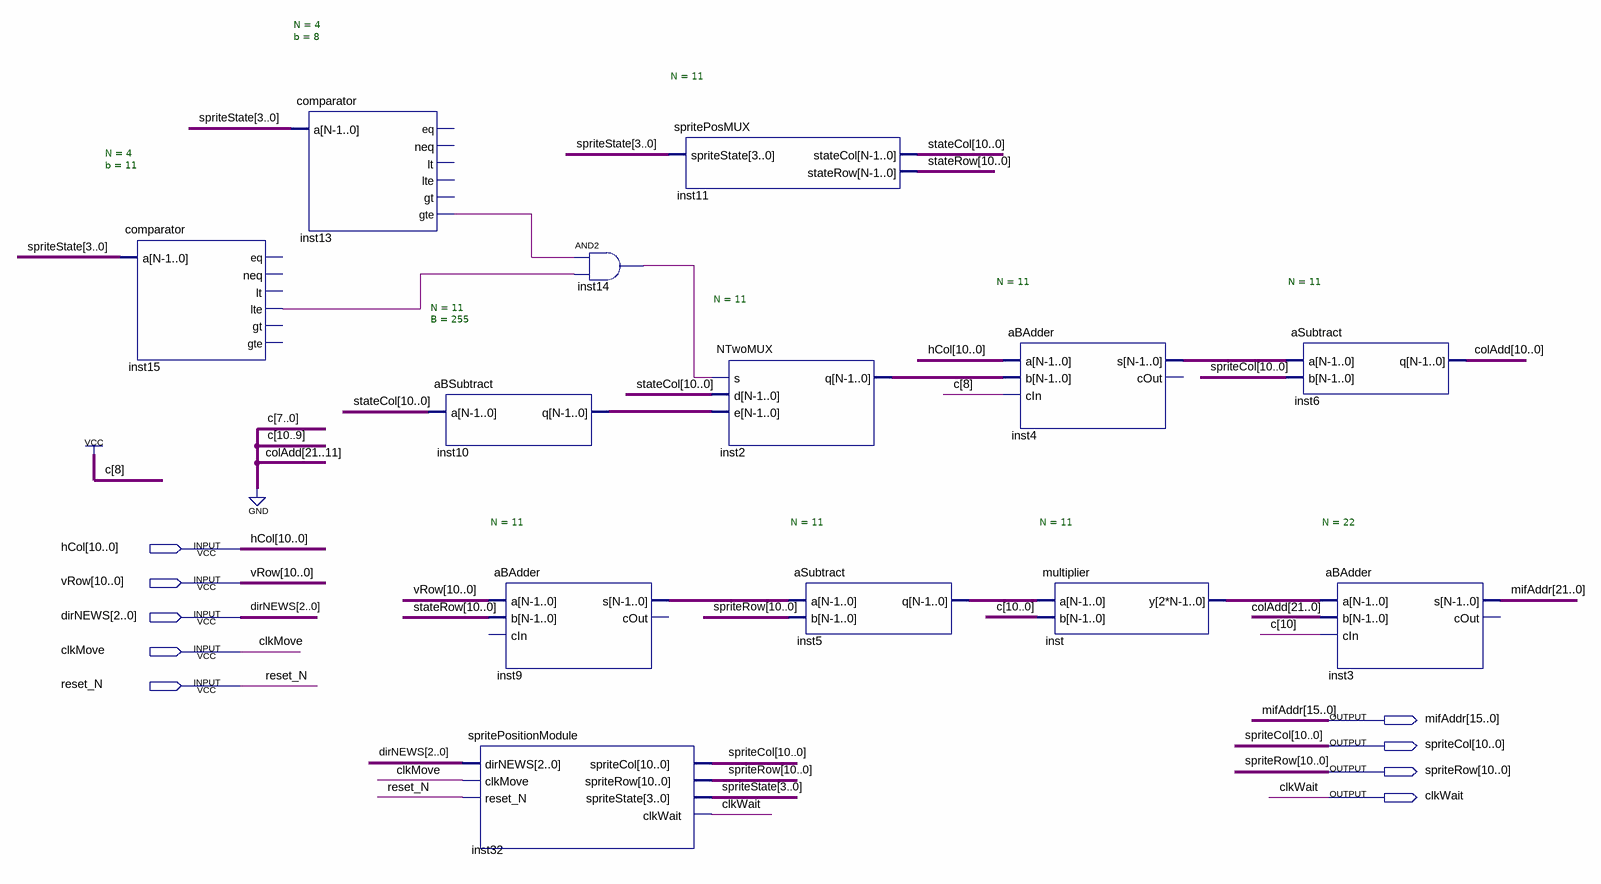
[diagram p0: schematic sheet]
// Quartus schematic newAddressConverter.bdf as structural Verilog: 13 symbols, 9 pins
module newAddressConverter (
  input  [10:0] hCol,
  input  [10:0] vRow,
  input  [2:0] dirNEWS,
  input  clkMove,
  input  reset_N,
  output [21:0] mifAddr,
  output [10:0] spriteCol,
  output [10:0] spriteRow,
  output clkWait
);

  wire inst13_gte, inst14_out, inst15_lte;
  wire [3:0] spriteState;
  wire [10:0] c, colAdd, inst2_q, inst4_s, inst5_q, inst9_s, inst10_q, stateCol, stateRow;
  wire [21:0] inst_y;

  comparator #(.N(4), .b(11)) inst15 (.a(spriteState), .lte(inst15_lte));  // open: eq, neq, lt, gt, gte
  comparator #(.N(4), .b(8)) inst13 (.a(spriteState), .gte(inst13_gte));  // open: eq, neq, lt, lte, gt
  aBSubtract #(.N(11), .B(255)) inst10 (.a(stateCol), .q(inst10_q));
  aBAdder #(.N(11)) inst9 (.a(vRow), .b(stateRow), .s(inst9_s));  // open: cIn, cOut
  spritePositionModule inst32 (
    .dirNEWS(dirNEWS), .clkMove(clkMove), .reset_N(reset_N), .spriteCol(spriteCol), .spriteRow(spriteRow),
    .spriteState(spriteState), .clkWait(clkWait));
  and inst14 (inst14_out, inst13_gte, inst15_lte);
  spritePosMUX #(.N(11)) inst11 (.spriteState(spriteState), .stateCol(stateCol), .stateRow(stateRow));
  NTwoMUX #(.N(11)) inst2 (.s(inst14_out), .d(stateCol), .e(inst10_q), .q(inst2_q));
  aSubtract #(.N(11)) inst5 (.a(inst9_s), .b(spriteRow), .q(inst5_q));
  aBAdder #(.N(11)) inst4 (.a(hCol), .b(inst2_q), .cIn(1'b1), .s(inst4_s));  // open: cOut
  multiplier #(.N(11)) inst (.a(inst5_q), .b({c[10:9], 1'b1, c[7:0]}), .y(inst_y));
  aSubtract #(.N(11)) inst6 (.a(inst4_s), .b(spriteCol), .q(colAdd));
  aBAdder #(.N(22)) inst3 (.a(inst_y), .b({{11{1'b0}}, colAdd}), .cIn(c[10]), .s(mifAddr));  // open: cOut
endmodule
